# Altium schematic sheet 2_mb_conn.SchDoc: MB connectors
size A4; SheetNumber: 2; SheetTotal: 4
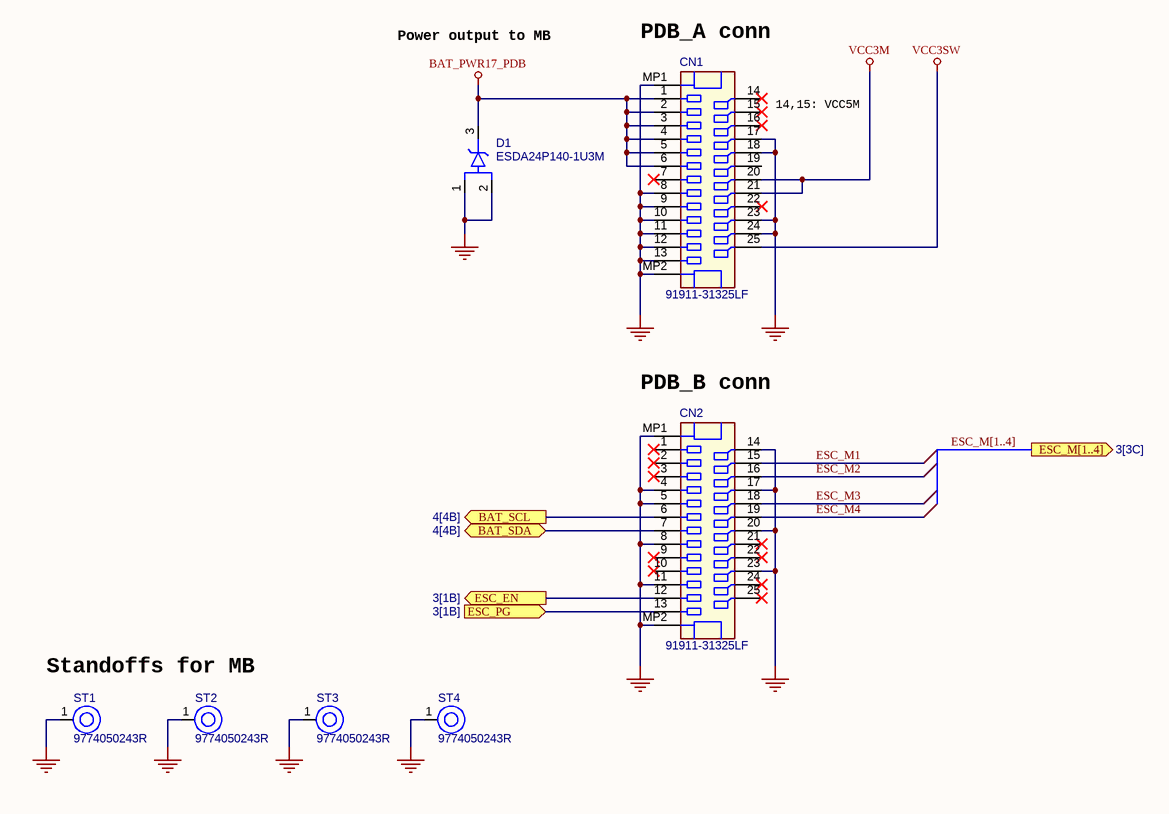
[diagram p0: 2_mb_conn.SchDoc]

## Parts
CN1  91911-31325LF  [AMPH-91911-31325_V]
CN2  91911-31325LF  [AMPH-91911-31325_V]
D1  ESDA24P140-1U3M  [STM-QFN3]
ST1  9774050243R  [WE-9774050243R_V]
ST2  9774050243R  [WE-9774050243R_V]
ST3  9774050243R  [WE-9774050243R_V]
ST4  9774050243R  [WE-9774050243R_V]

## Ports
BAT_SCL (out, see 4[4B]), BAT_SDA (bidir, see 4[4B]), ESC_EN (out, see 3[1B]), ESC_M[1..4] (out, see 3[3C]), ESC_PG (in, see 3[1B])

## Nets
BAT_PWR17_PDB: CN1.1 CN1.2 CN1.3 CN1.4 CN1.5 CN1.6 D1.3(K)
GND: CN1.8 CN1.9 CN1.10 CN1.11 CN1.12 CN1.13 CN1.17 CN1.18 CN1.23 CN1.24 CN1.MP1 CN1.MP2 CN2.4 CN2.5 CN2.8 CN2.11 CN2.14 CN2.17 CN2.20 CN2.23 CN2.MP1 CN2.MP2 D1.1(A) D1.2(A) ST1.1(H1) ST2.1(H1) ST3.1(H1) ST4.1(H1)
VCC3M: CN1.20 CN1.21
VCC3SW: CN1.25
BAT_SCL: CN2.6 ; port BAT_SCL
BAT_SDA: CN2.7 ; port BAT_SDA
ESC_EN: CN2.12 ; port ESC_EN
ESC_M1: CN2.15
ESC_M2: CN2.16
ESC_M3: CN2.18
ESC_M4: CN2.19
ESC_PG: CN2.13 ; port ESC_PG

Not connected (* = marked no-connect by the designer): CN1 7* 14* 15* 16* 19 22*; CN2 1* 2* 3* 9* 10* 21* 22* 24* 25*

## Buses and harness runs
bus ESC_M[1..4] = port ESC_M[1..4]

## Notes on the sheet
- Power output to MB
- (near CN1) PDB_A conn
- (near CN1) 14,15: VCC5M
- (near CN2) PDB_B conn
- Standoffs for MB
- Title
- Size:
- Date:
- A4
- Number:
- Time:
- Revision:
- Sheet
- of
- File:

## Library data of the parts
CN1 CN2 = CMP-002-00064-3: Header, Pitch 1 mm, 25 Position, Height 5 mm, -55 to 130 degC; Pins: 27
D1 = CMP-004-00029-3: TVS diode, 4500W, 22V standoff, 29.5V clamp; Peak Inverse Voltage: 22.7V; Forward Voltage: 700mV; Max Surge Current: 140A; Case/Package: 3-QFN; Mounting Technology: SMT; RoHS Compliant: Yes; Pins: 3
ST1-ST4 = CMP-00028-00006-2: WA-SMSI SMT Steel Spacer, M2 Thread Internal, Tin, RoHS, Tape and Reel; Pins: 1